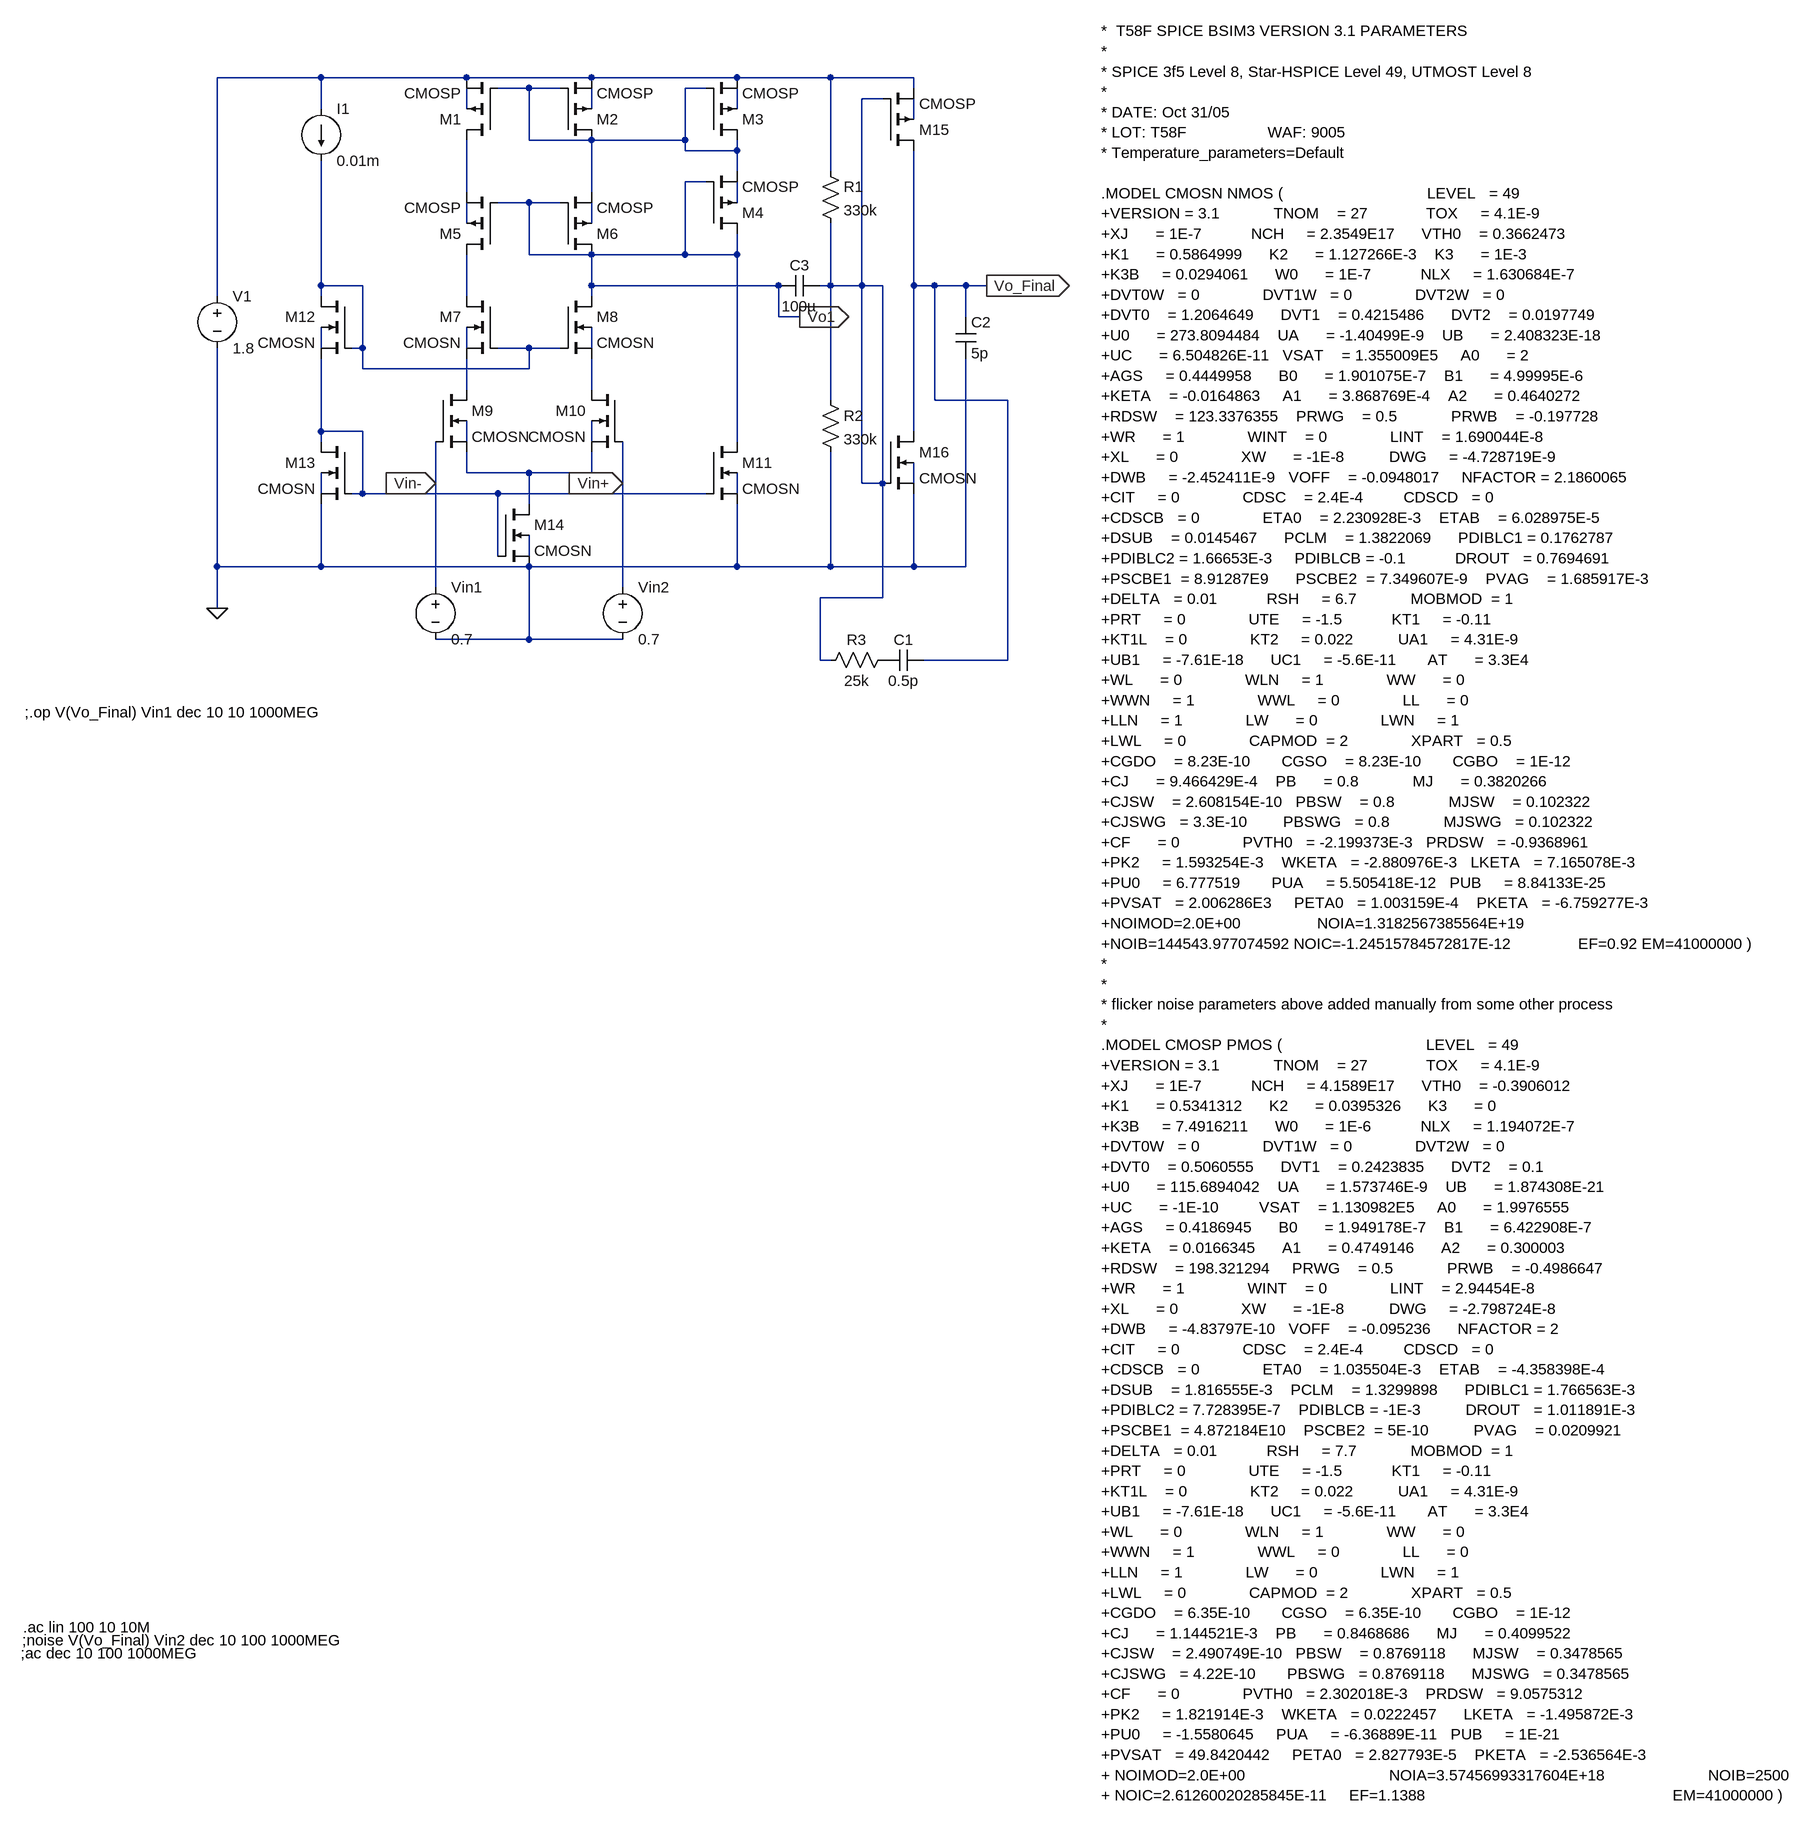
[diagram p0: schematic project_finally_finaklly_thoda.asc]
project_finally_finaklly_thoda.asc, the LTspice schematic file:
Version 4
SHEET 1 2260 2296
WIRE -80 -144 -240 -144
WIRE 144 -144 -80 -144
WIRE 336 -144 144 -144
WIRE 560 -144 336 -144
WIRE 704 -144 560 -144
WIRE 832 -144 704 -144
WIRE 240 -128 192 -128
WIRE 288 -128 240 -128
WIRE 512 -128 480 -128
WIRE 832 -128 832 -144
WIRE 784 -112 752 -112
WIRE -80 -96 -80 -144
WIRE 144 -96 144 -128
WIRE 336 -96 336 -128
WIRE 560 -96 560 -128
WIRE 832 -80 832 -112
WIRE 240 -48 240 -128
WIRE 336 -48 240 -48
WIRE 480 -48 480 -128
WIRE 480 -48 336 -48
WIRE 480 -32 480 -48
WIRE 560 -32 560 -48
WIRE 560 -32 480 -32
WIRE 560 0 560 -32
WIRE 704 0 704 -144
WIRE 512 16 480 16
WIRE 144 32 144 -48
WIRE 336 32 336 -48
WIRE 240 48 192 48
WIRE 288 48 240 48
WIRE 560 48 560 16
WIRE 144 80 144 48
WIRE 336 80 336 48
WIRE 240 128 240 48
WIRE 336 128 240 128
WIRE 480 128 480 16
WIRE 480 128 336 128
WIRE 560 128 560 96
WIRE 560 128 480 128
WIRE -80 176 -80 -16
WIRE -16 176 -80 176
WIRE 336 176 336 128
WIRE 624 176 336 176
WIRE 704 176 704 80
WIRE 704 176 688 176
WIRE 752 176 752 -112
WIRE 752 176 704 176
WIRE 784 176 752 176
WIRE 832 176 832 -32
WIRE 864 176 832 176
WIRE 912 176 864 176
WIRE 944 176 912 176
WIRE -240 192 -240 -144
WIRE -80 192 -80 176
WIRE 144 192 144 128
WIRE 336 192 336 176
WIRE 624 224 624 176
WIRE 656 224 624 224
WIRE 912 224 912 176
WIRE -80 272 -80 240
WIRE -16 272 -16 176
WIRE -16 272 -32 272
WIRE 144 272 144 240
WIRE 240 272 192 272
WIRE 288 272 240 272
WIRE 336 272 336 240
WIRE -16 304 -16 272
WIRE 240 304 240 272
WIRE 240 304 -16 304
WIRE 144 336 144 288
WIRE 336 336 336 288
WIRE 704 352 704 176
WIRE 864 352 864 176
WIRE 976 352 864 352
WIRE -80 400 -80 288
WIRE -16 400 -80 400
WIRE 832 400 832 176
WIRE -80 416 -80 400
WIRE 144 416 144 384
WIRE 336 416 336 384
WIRE 560 416 560 128
WIRE 144 464 144 432
WIRE 240 464 144 464
WIRE 336 464 336 432
WIRE 336 464 240 464
WIRE 96 480 96 416
WIRE 384 480 384 416
WIRE 752 480 752 176
WIRE 784 480 784 176
WIRE 784 480 752 480
WIRE 832 480 832 448
WIRE -80 496 -80 464
WIRE -16 496 -16 400
WIRE -16 496 -32 496
WIRE 192 496 -16 496
WIRE 512 496 192 496
WIRE 560 496 560 464
WIRE 240 512 240 464
WIRE 192 592 192 496
WIRE 240 592 240 560
WIRE -240 608 -240 272
WIRE -80 608 -80 512
WIRE -80 608 -240 608
WIRE 240 608 -80 608
WIRE 560 608 560 512
WIRE 560 608 240 608
WIRE 704 608 704 432
WIRE 704 608 560 608
WIRE 832 608 832 496
WIRE 832 608 704 608
WIRE 912 608 912 288
WIRE 912 608 832 608
WIRE 96 640 96 480
WIRE 384 640 384 480
WIRE 784 656 784 480
WIRE 784 656 688 656
WIRE -240 672 -240 608
WIRE 240 720 240 608
WIRE 240 720 96 720
WIRE 384 720 240 720
WIRE 688 752 688 656
WIRE 704 752 688 752
WIRE 976 752 976 352
WIRE 976 752 848 752
FLAG -240 672 0
FLAG 656 224 Vo1
IOPIN 656 224 Out
FLAG 384 480 Vin+
IOPIN 384 480 In
FLAG 96 480 Vin-
IOPIN 96 480 In
FLAG 944 176 Vo_Final
IOPIN 944 176 Out
DATAFLAG 384 432 ""
DATAFLAG 320 464 ""
DATAFLAG 336 320 ""
DATAFLAG 144 320 ""
DATAFLAG 96 448 ""
DATAFLAG 240 272 ""
DATAFLAG 144 176 ""
DATAFLAG 336 176 ""
DATAFLAG 240 48 ""
DATAFLAG 336 16 ""
SYMBOL current -80 -96 R0
WINDOW 123 0 0 Left 0
WINDOW 39 0 0 Left 0
SYMATTR InstName I1
SYMATTR Value 0.01m
SYMBOL pmos4 192 -48 R180
SYMATTR InstName M1
SYMATTR Value CMOSP
SYMATTR Value2 l=0.2u w=10u
SYMBOL pmos4 288 -48 M180
SYMATTR InstName M2
SYMATTR Value CMOSP
SYMATTR Value2 l=0.2u w=10u
SYMBOL pmos4 512 -48 M180
SYMATTR InstName M3
SYMATTR Value CMOSP
SYMATTR Value2 l=0.2u w=1u
SYMBOL pmos4 512 96 M180
SYMATTR InstName M4
SYMATTR Value CMOSP
SYMATTR Value2 l=0.2u w=1u
SYMBOL pmos4 192 128 R180
SYMATTR InstName M5
SYMATTR Value CMOSP
SYMATTR Value2 l=0.2u w=10u
SYMBOL pmos4 288 128 M180
SYMATTR InstName M6
SYMATTR Value CMOSP
SYMATTR Value2 l=0.2u w=10u
SYMBOL nmos4 192 192 M0
SYMATTR InstName M7
SYMATTR Value CMOSN
SYMATTR Value2 l=0.2u w=10u
SYMBOL nmos4 288 192 R0
SYMATTR InstName M8
SYMATTR Value CMOSN
SYMATTR Value2 l=0.2u w=10u
SYMBOL nmos4 96 336 R0
SYMATTR InstName M9
SYMATTR Value CMOSN
SYMATTR Value2 l=0.2u w=10u
SYMBOL nmos4 384 336 M0
SYMATTR InstName M10
SYMATTR Value CMOSN
SYMATTR Value2 l=0.2u w=10u
SYMBOL nmos4 512 416 R0
SYMATTR InstName M11
SYMATTR Value CMOSN
SYMATTR Value2 l=0.2u w=1u
SYMBOL nmos4 -32 192 M0
SYMATTR InstName M12
SYMATTR Value CMOSN
SYMATTR Value2 l=0.2u w=1u
SYMBOL nmos4 -32 416 M0
SYMATTR InstName M13
SYMATTR Value CMOSN
SYMATTR Value2 l=0.2u w=1u
SYMBOL nmos4 192 512 R0
SYMATTR InstName M14
SYMATTR Value CMOSN
SYMATTR Value2 l=0.2u w=20u
SYMBOL voltage -240 176 R0
WINDOW 123 0 0 Left 0
WINDOW 39 0 0 Left 0
SYMATTR InstName V1
SYMATTR Value 1.8
SYMBOL voltage 96 624 R0
WINDOW 39 0 0 Left 0
SYMATTR InstName Vin1
SYMATTR Value 0.7
SYMATTR Value2 AC 1 0
SYMBOL voltage 384 624 R0
WINDOW 39 0 0 Left 0
SYMATTR InstName Vin2
SYMATTR Value 0.7
SYMATTR Value2 AC 1 180
SYMBOL pmos4 784 -32 M180
SYMATTR InstName M15
SYMATTR Value CMOSP
SYMATTR Value2 l=1.2312u w=2.84u
SYMBOL nmos4 784 400 R0
SYMATTR InstName M16
SYMATTR Value CMOSN
SYMATTR Value2 l=1.2312u w=0.6615u
SYMBOL cap 896 224 R0
SYMATTR InstName C2
SYMATTR Value 5p
SYMBOL res 688 -16 R0
SYMATTR InstName R1
SYMATTR Value 330k
SYMBOL res 688 336 R0
SYMATTR InstName R2
SYMATTR Value 330k
SYMBOL cap 688 160 R90
WINDOW 0 0 32 VBottom 2
WINDOW 3 32 32 VTop 2
SYMATTR InstName C3
SYMATTR Value 100µ
SYMBOL res 800 736 R90
WINDOW 0 0 56 VBottom 2
WINDOW 3 32 56 VTop 2
SYMATTR InstName R3
SYMATTR Value 25k
SYMBOL cap 848 736 R90
WINDOW 0 0 32 VBottom 2
WINDOW 3 32 32 VTop 2
SYMATTR InstName C1
SYMATTR Value 0.5p
TEXT 1120 -216 Left 2 !*  T58F SPICE BSIM3 VERSION 3.1 PARAMETERS\n* \n* SPICE 3f5 Level 8, Star-HSPICE Level 49, UTMOST Level 8\n* \n* DATE: Oct 31/05\n* LOT: T58F                  WAF: 9005\n* Temperature_parameters=Default\n \n.MODEL CMOSN NMOS (                                LEVEL   = 49\n+VERSION = 3.1            TNOM    = 27             TOX     = 4.1E-9\n+XJ      = 1E-7           NCH     = 2.3549E17      VTH0    = 0.3662473\n+K1      = 0.5864999      K2      = 1.127266E-3    K3      = 1E-3\n+K3B     = 0.0294061      W0      = 1E-7           NLX     = 1.630684E-7\n+DVT0W   = 0              DVT1W   = 0              DVT2W   = 0\n+DVT0    = 1.2064649      DVT1    = 0.4215486      DVT2    = 0.0197749\n+U0      = 273.8094484    UA      = -1.40499E-9    UB      = 2.408323E-18\n+UC      = 6.504826E-11   VSAT    = 1.355009E5     A0      = 2\n+AGS     = 0.4449958      B0      = 1.901075E-7    B1      = 4.99995E-6\n+KETA    = -0.0164863     A1      = 3.868769E-4    A2      = 0.4640272\n+RDSW    = 123.3376355    PRWG    = 0.5            PRWB    = -0.197728\n+WR      = 1              WINT    = 0              LINT    = 1.690044E-8\n+XL      = 0              XW      = -1E-8          DWG     = -4.728719E-9\n+DWB     = -2.452411E-9   VOFF    = -0.0948017     NFACTOR = 2.1860065\n+CIT     = 0              CDSC    = 2.4E-4         CDSCD   = 0\n+CDSCB   = 0              ETA0    = 2.230928E-3    ETAB    = 6.028975E-5\n+DSUB    = 0.0145467      PCLM    = 1.3822069      PDIBLC1 = 0.1762787\n+PDIBLC2 = 1.66653E-3     PDIBLCB = -0.1           DROUT   = 0.7694691\n+PSCBE1  = 8.91287E9      PSCBE2  = 7.349607E-9    PVAG    = 1.685917E-3\n+DELTA   = 0.01           RSH     = 6.7            MOBMOD  = 1\n+PRT     = 0              UTE     = -1.5           KT1     = -0.11\n+KT1L    = 0              KT2     = 0.022          UA1     = 4.31E-9\n+UB1     = -7.61E-18      UC1     = -5.6E-11       AT      = 3.3E4\n+WL      = 0              WLN     = 1              WW      = 0\n+WWN     = 1              WWL     = 0              LL      = 0\n+LLN     = 1              LW      = 0              LWN     = 1\n+LWL     = 0              CAPMOD  = 2              XPART   = 0.5\n+CGDO    = 8.23E-10       CGSO    = 8.23E-10       CGBO    = 1E-12\n+CJ      = 9.466429E-4    PB      = 0.8            MJ      = 0.3820266\n+CJSW    = 2.608154E-10   PBSW    = 0.8            MJSW    = 0.102322\n+CJSWG   = 3.3E-10        PBSWG   = 0.8            MJSWG   = 0.102322\n+CF      = 0              PVTH0   = -2.199373E-3   PRDSW   = -0.9368961\n+PK2     = 1.593254E-3    WKETA   = -2.880976E-3   LKETA   = 7.165078E-3\n+PU0     = 6.777519       PUA     = 5.505418E-12   PUB     = 8.84133E-25\n+PVSAT   = 2.006286E3     PETA0   = 1.003159E-4    PKETA   = -6.759277E-3\n+NOIMOD=2.0E+00                 NOIA=1.3182567385564E+19\n+NOIB=144543.977074592 NOIC=-1.24515784572817E-12               EF=0.92 EM=41000000 )\n*\n*\n* flicker noise parameters above added manually from some other process\n* \n.MODEL CMOSP PMOS (                                LEVEL   = 49\n+VERSION = 3.1            TNOM    = 27             TOX     = 4.1E-9\n+XJ      = 1E-7           NCH     = 4.1589E17      VTH0    = -0.3906012\n+K1      = 0.5341312      K2      = 0.0395326      K3      = 0\n+K3B     = 7.4916211      W0      = 1E-6           NLX     = 1.194072E-7\n+DVT0W   = 0              DVT1W   = 0              DVT2W   = 0\n+DVT0    = 0.5060555      DVT1    = 0.2423835      DVT2    = 0.1\n+U0      = 115.6894042    UA      = 1.573746E-9    UB      = 1.874308E-21\n+UC      = -1E-10         VSAT    = 1.130982E5     A0      = 1.9976555\n+AGS     = 0.4186945      B0      = 1.949178E-7    B1      = 6.422908E-7\n+KETA    = 0.0166345      A1      = 0.4749146      A2      = 0.300003\n+RDSW    = 198.321294     PRWG    = 0.5            PRWB    = -0.4986647\n+WR      = 1              WINT    = 0              LINT    = 2.94454E-8\n+XL      = 0              XW      = -1E-8          DWG     = -2.798724E-8\n+DWB     = -4.83797E-10   VOFF    = -0.095236      NFACTOR = 2\n+CIT     = 0              CDSC    = 2.4E-4         CDSCD   = 0\n+CDSCB   = 0              ETA0    = 1.035504E-3    ETAB    = -4.358398E-4\n+DSUB    = 1.816555E-3    PCLM    = 1.3299898      PDIBLC1 = 1.766563E-3\n+PDIBLC2 = 7.728395E-7    PDIBLCB = -1E-3          DROUT   = 1.011891E-3\n+PSCBE1  = 4.872184E10    PSCBE2  = 5E-10          PVAG    = 0.0209921\n+DELTA   = 0.01           RSH     = 7.7            MOBMOD  = 1\n+PRT     = 0              UTE     = -1.5           KT1     = -0.11\n+KT1L    = 0              KT2     = 0.022          UA1     = 4.31E-9\n+UB1     = -7.61E-18      UC1     = -5.6E-11       AT      = 3.3E4\n+WL      = 0              WLN     = 1              WW      = 0\n+WWN     = 1              WWL     = 0              LL      = 0\n+LLN     = 1              LW      = 0              LWN     = 1\n+LWL     = 0              CAPMOD  = 2              XPART   = 0.5\n+CGDO    = 6.35E-10       CGSO    = 6.35E-10       CGBO    = 1E-12\n+CJ      = 1.144521E-3    PB      = 0.8468686      MJ      = 0.4099522\n+CJSW    = 2.490749E-10   PBSW    = 0.8769118      MJSW    = 0.3478565\n+CJSWG   = 4.22E-10       PBSWG   = 0.8769118      MJSWG   = 0.3478565\n+CF      = 0              PVTH0   = 2.302018E-3    PRDSW   = 9.0575312\n+PK2     = 1.821914E-3    WKETA   = 0.0222457      LKETA   = -1.495872E-3\n+PU0     = -1.5580645     PUA     = -6.36889E-11   PUB     = 1E-21\n+PVSAT   = 49.8420442     PETA0   = 2.827793E-5    PKETA   = -2.536564E-3 \n+ NOIMOD=2.0E+00                                NOIA=3.57456993317604E+18                       NOIB=2500\n+ NOIC=2.61260020285845E-11     EF=1.1388                                                       EM=41000000 )
TEXT -536 832 Left 2 !;.op V(Vo_Final) Vin1 dec 10 10 1000MEG
TEXT -538 2240 Left 2 !.ac lin 100 10 10M
TEXT -540 2260 Left 2 !;noise V(Vo_Final) Vin2 dec 10 100 1000MEG
TEXT -542 2280 Left 2 !;ac dec 10 100 1000MEG

The netlist it stands for:
* project_finally_finaklly_thoda.asc
I1 N001 N012 0.01m
M1 N008 N002 N001 N004 CMOSP l=0.2u w=10u
M2 N002 N002 N001 N005 CMOSP l=0.2u w=10u
M3 N002 N002 N001 N006 CMOSP l=0.2u w=1u
M4 Vo1 Vo1 N002 N009 CMOSP l=0.2u w=1u
M5 N013 Vo1 N008 N010 CMOSP l=0.2u w=10u
M6 Vo1 Vo1 N002 N011 CMOSP l=0.2u w=10u
M7 N013 N012 N017 N015 CMOSN l=0.2u w=10u
M8 Vo1 N012 N018 N016 CMOSN l=0.2u w=10u
M9 N017 Vin- N022 N020 CMOSN l=0.2u w=10u
M10 N018 Vin+ N022 N021 CMOSN l=0.2u w=10u
M11 Vo1 N019 0 N025 CMOSN l=0.2u w=1u
M12 N012 N012 N019 N014 CMOSN l=0.2u w=1u
M13 N019 N019 0 N024 CMOSN l=0.2u w=1u
M14 N022 N019 0 N026 CMOSN l=0.2u w=20u
V1 N001 0 1.8
Vin1 Vin- 0 0.7 AC 1 0
Vin2 Vin+ 0 0.7 AC 1 180
M15 Vo_Final N003 N001 N007 CMOSP l=1.2312u w=2.84u
M16 Vo_Final N003 0 N023 CMOSN l=1.2312u w=0.6615u
C2 Vo_Final 0 5p
R1 N001 N003 330k
R2 N003 0 330k
C3 N003 Vo1 100µ
R3 P001 N003 25k
C1 Vo_Final P001 0.5p
.model NMOS NMOS
.model PMOS PMOS
.lib standard.mos
*  T58F SPICE BSIM3 VERSION 3.1 PARAMETERS
*
* SPICE 3f5 Level 8, Star-HSPICE Level 49, UTMOST Level 8
*
* DATE: Oct 31/05
* LOT: T58F                  WAF: 9005
* Temperature_parameters=Default
.MODEL CMOSN NMOS (                                LEVEL   = 49
+VERSION = 3.1            TNOM    = 27             TOX     = 4.1E-9
+XJ      = 1E-7           NCH     = 2.3549E17      VTH0    = 0.3662473
+K1      = 0.5864999      K2      = 1.127266E-3    K3      = 1E-3
+K3B     = 0.0294061      W0      = 1E-7           NLX     = 1.630684E-7
+DVT0W   = 0              DVT1W   = 0              DVT2W   = 0
+DVT0    = 1.2064649      DVT1    = 0.4215486      DVT2    = 0.0197749
+U0      = 273.8094484    UA      = -1.40499E-9    UB      = 2.408323E-18
+UC      = 6.504826E-11   VSAT    = 1.355009E5     A0      = 2
+AGS     = 0.4449958      B0      = 1.901075E-7    B1      = 4.99995E-6
+KETA    = -0.0164863     A1      = 3.868769E-4    A2      = 0.4640272
+RDSW    = 123.3376355    PRWG    = 0.5            PRWB    = -0.197728
+WR      = 1              WINT    = 0              LINT    = 1.690044E-8
+XL      = 0              XW      = -1E-8          DWG     = -4.728719E-9
+DWB     = -2.452411E-9   VOFF    = -0.0948017     NFACTOR = 2.1860065
+CIT     = 0              CDSC    = 2.4E-4         CDSCD   = 0
+CDSCB   = 0              ETA0    = 2.230928E-3    ETAB    = 6.028975E-5
+DSUB    = 0.0145467      PCLM    = 1.3822069      PDIBLC1 = 0.1762787
+PDIBLC2 = 1.66653E-3     PDIBLCB = -0.1           DROUT   = 0.7694691
+PSCBE1  = 8.91287E9      PSCBE2  = 7.349607E-9    PVAG    = 1.685917E-3
+DELTA   = 0.01           RSH     = 6.7            MOBMOD  = 1
+PRT     = 0              UTE     = -1.5           KT1     = -0.11
+KT1L    = 0              KT2     = 0.022          UA1     = 4.31E-9
+UB1     = -7.61E-18      UC1     = -5.6E-11       AT      = 3.3E4
+WL      = 0              WLN     = 1              WW      = 0
+WWN     = 1              WWL     = 0              LL      = 0
+LLN     = 1              LW      = 0              LWN     = 1
+LWL     = 0              CAPMOD  = 2              XPART   = 0.5
+CGDO    = 8.23E-10       CGSO    = 8.23E-10       CGBO    = 1E-12
+CJ      = 9.466429E-4    PB      = 0.8            MJ      = 0.3820266
+CJSW    = 2.608154E-10   PBSW    = 0.8            MJSW    = 0.102322
+CJSWG   = 3.3E-10        PBSWG   = 0.8            MJSWG   = 0.102322
+CF      = 0              PVTH0   = -2.199373E-3   PRDSW   = -0.9368961
+PK2     = 1.593254E-3    WKETA   = -2.880976E-3   LKETA   = 7.165078E-3
+PU0     = 6.777519       PUA     = 5.505418E-12   PUB     = 8.84133E-25
+PVSAT   = 2.006286E3     PETA0   = 1.003159E-4    PKETA   = -6.759277E-3
+NOIMOD=2.0E+00                 NOIA=1.3182567385564E+19
+NOIB=144543.977074592 NOIC=-1.24515784572817E-12               EF=0.92 EM=41000000 )
*
*
* flicker noise parameters above added manually from some other process
*
.MODEL CMOSP PMOS (                                LEVEL   = 49
+VERSION = 3.1            TNOM    = 27             TOX     = 4.1E-9
+XJ      = 1E-7           NCH     = 4.1589E17      VTH0    = -0.3906012
+K1      = 0.5341312      K2      = 0.0395326      K3      = 0
+K3B     = 7.4916211      W0      = 1E-6           NLX     = 1.194072E-7
+DVT0W   = 0              DVT1W   = 0              DVT2W   = 0
+DVT0    = 0.5060555      DVT1    = 0.2423835      DVT2    = 0.1
+U0      = 115.6894042    UA      = 1.573746E-9    UB      = 1.874308E-21
+UC      = -1E-10         VSAT    = 1.130982E5     A0      = 1.9976555
+AGS     = 0.4186945      B0      = 1.949178E-7    B1      = 6.422908E-7
+KETA    = 0.0166345      A1      = 0.4749146      A2      = 0.300003
+RDSW    = 198.321294     PRWG    = 0.5            PRWB    = -0.4986647
+WR      = 1              WINT    = 0              LINT    = 2.94454E-8
+XL      = 0              XW      = -1E-8          DWG     = -2.798724E-8
+DWB     = -4.83797E-10   VOFF    = -0.095236      NFACTOR = 2
+CIT     = 0              CDSC    = 2.4E-4         CDSCD   = 0
+CDSCB   = 0              ETA0    = 1.035504E-3    ETAB    = -4.358398E-4
+DSUB    = 1.816555E-3    PCLM    = 1.3299898      PDIBLC1 = 1.766563E-3
+PDIBLC2 = 7.728395E-7    PDIBLCB = -1E-3          DROUT   = 1.011891E-3
+PSCBE1  = 4.872184E10    PSCBE2  = 5E-10          PVAG    = 0.0209921
+DELTA   = 0.01           RSH     = 7.7            MOBMOD  = 1
+PRT     = 0              UTE     = -1.5           KT1     = -0.11
+KT1L    = 0              KT2     = 0.022          UA1     = 4.31E-9
+UB1     = -7.61E-18      UC1     = -5.6E-11       AT      = 3.3E4
+WL      = 0              WLN     = 1              WW      = 0
+WWN     = 1              WWL     = 0              LL      = 0
+LLN     = 1              LW      = 0              LWN     = 1
+LWL     = 0              CAPMOD  = 2              XPART   = 0.5
+CGDO    = 6.35E-10       CGSO    = 6.35E-10       CGBO    = 1E-12
+CJ      = 1.144521E-3    PB      = 0.8468686      MJ      = 0.4099522
+CJSW    = 2.490749E-10   PBSW    = 0.8769118      MJSW    = 0.3478565
+CJSWG   = 4.22E-10       PBSWG   = 0.8769118      MJSWG   = 0.3478565
+CF      = 0              PVTH0   = 2.302018E-3    PRDSW   = 9.0575312
+PK2     = 1.821914E-3    WKETA   = 0.0222457      LKETA   = -1.495872E-3
+PU0     = -1.5580645     PUA     = -6.36889E-11   PUB     = 1E-21
+PVSAT   = 49.8420442     PETA0   = 2.827793E-5    PKETA   = -2.536564E-3
+ NOIMOD=2.0E+00                                NOIA=3.57456993317604E+18                       NOIB=2500
+ NOIC=2.61260020285845E-11     EF=1.1388                                                       EM=41000000 )
;.op V(Vo_Final) Vin1 dec 10 10 1000MEG
.ac lin 100 10 10M
;noise V(Vo_Final) Vin2 dec 10 100 1000MEG
;ac dec 10 100 1000MEG
.backanno
.end